# EAGLE design HDC1000_breakout (EAGLE 7.1.0)
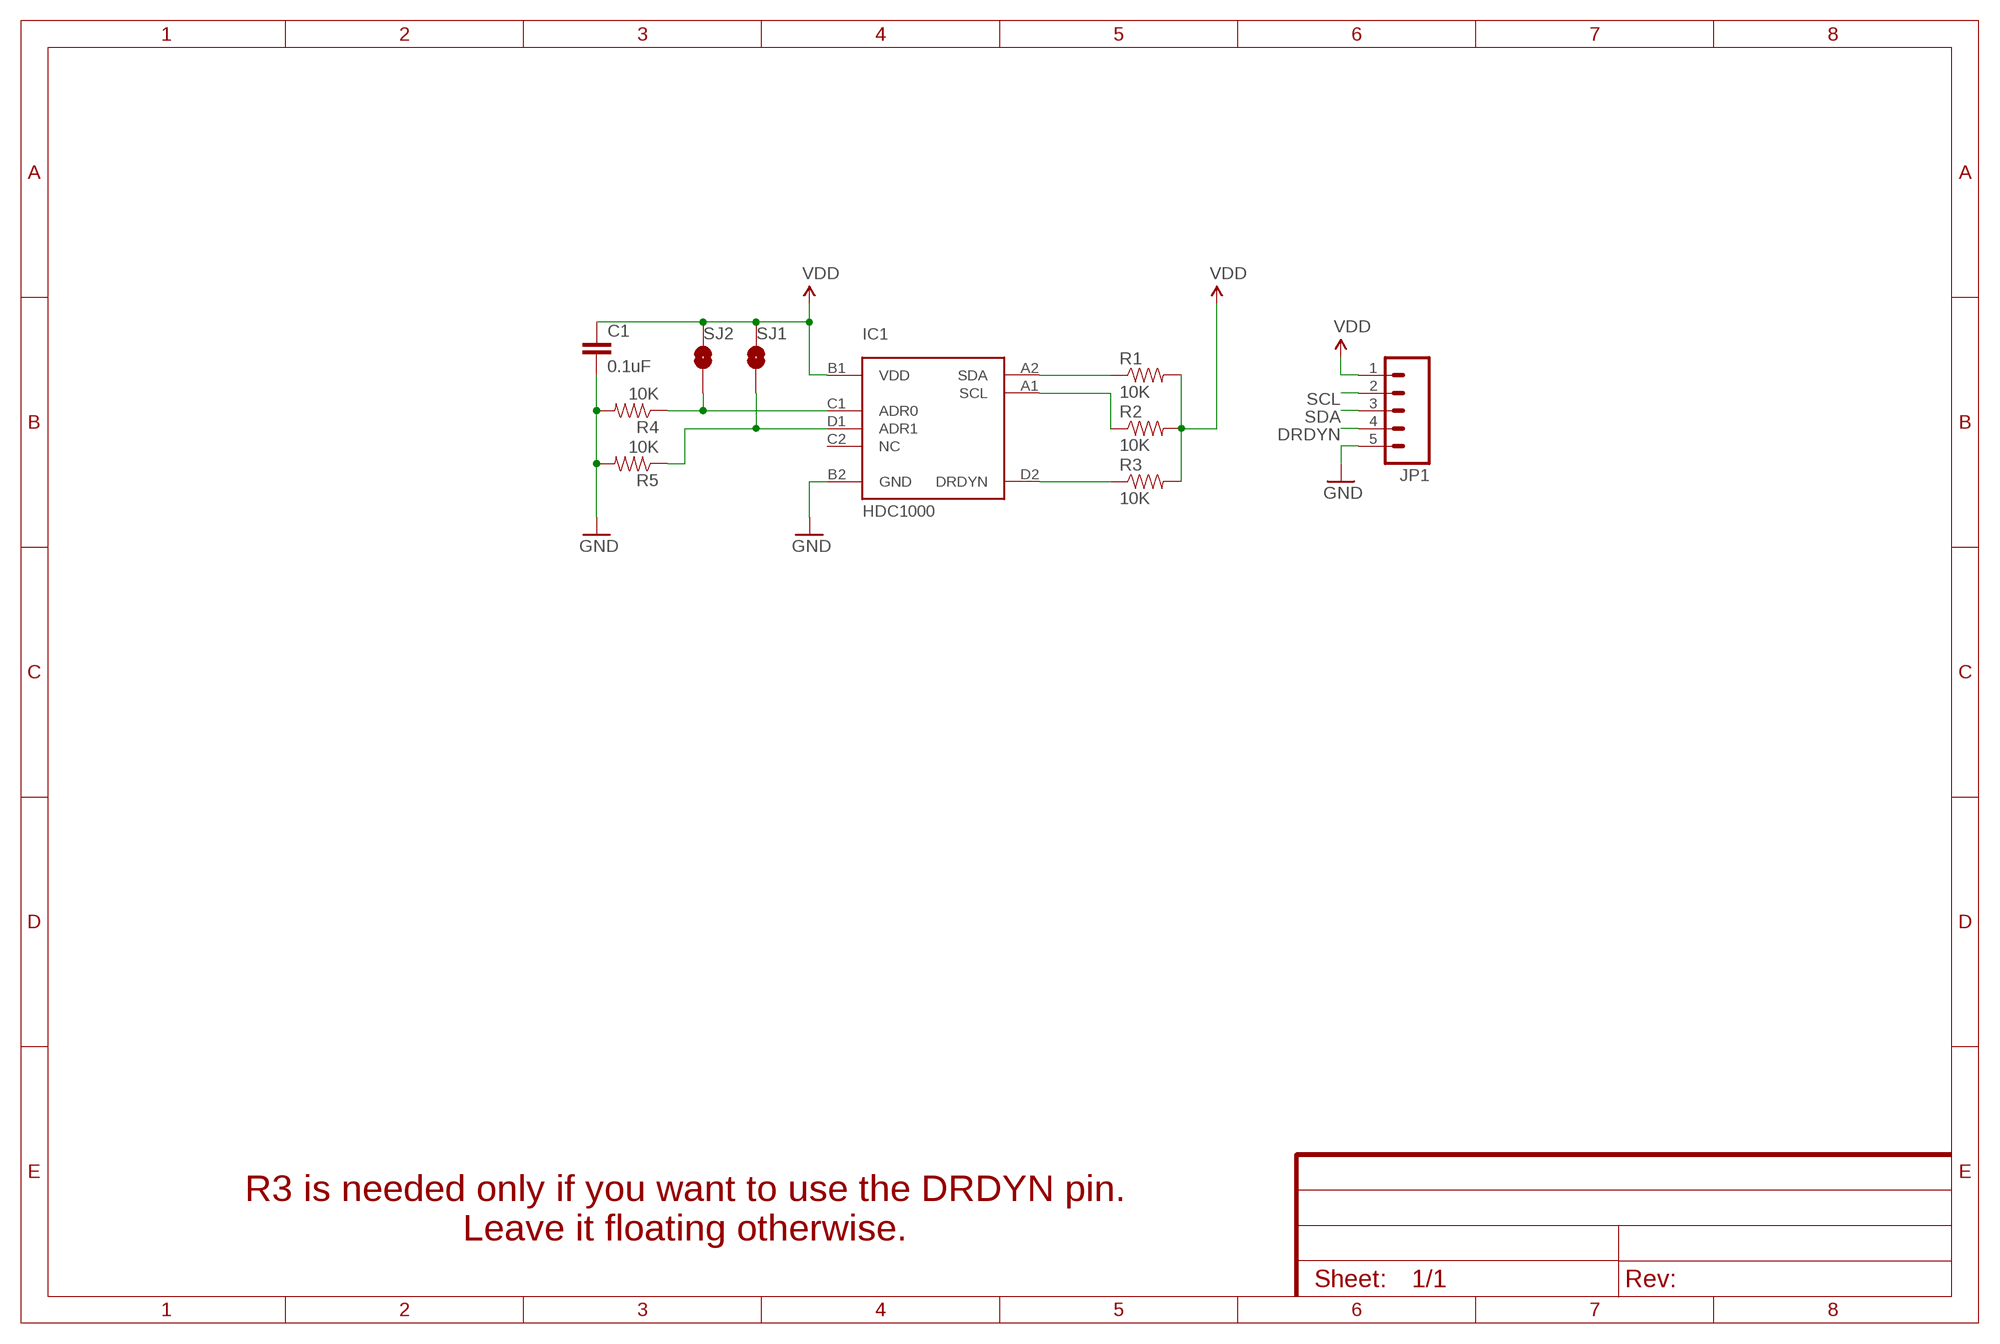
[diagram p0: schematic, sheet 1]
FRAME1 (FRAME-A4L): CNAME: HDC1000 Breakout Board; CREVISION: 1; DESIGNER: Francesco Truzzi; LICENSE: Released under CC BY-NC-SA 4.0

## Parts
C1  0.1uF  CAP0805  [0805]
IC1  HDC1000  [DSBGA_8_YPA]
JP1  M05LOCK  [1X05_LOCK]
R1  10K  RESISTOR0805-RES  [0805]
R2  10K  RESISTOR0805-RES  [0805]
R3  10K  RESISTOR0805-RES  [0805]
R4  10K  RESISTOR0805-RES  [0805]
R5  10K  RESISTOR0805-RES  [0805]
SJ1  SOLDERJUMPERNO  [SJ_2S-NO]
SJ2  SOLDERJUMPERNO  [SJ_2S-NO]

## Nets
DRDYN: IC1.D2(DRDYN) JP1.4 R3.1
GND: C1.2 IC1.B2(GND) JP1.5 R4.2 R5.2
N$1: IC1.D1(ADR1) R5.1 SJ1.2
N$2: IC1.C1(ADR0) R4.1 SJ2.2
SCL: IC1.A1(SCL) JP1.2 R2.1
SDA: IC1.A2(SDA) JP1.3 R1.1
VDD: C1.1 IC1.B1(VDD) JP1.1 R1.2 R2.2 R3.2 SJ1.1 SJ2.1
Unconnected: IC1.C2(NC)

## Notes on the sheet
- R3 is needed only if you want to use the DRDYN pin.
  Leave it floating otherwise.

## Library data of the parts
C1 = SparkFun-Passives:CAP: Capacitor Standard 0603 ceramic capacitor, and 0.1" leaded capacitor.
IC1 = Fra:HDC1000
JP1 = SparkFun-Connectors:M05: Header 5 Standard 5-pin 0.1" header. Use with straight break away headers (SKU : PRT-00116), right angle break away headers (PRT-00553), swiss pins (PRT-00743), machine pins (PRT-00117), and female headers (PRT-00115). Molex polarized connector foot print use with SKU : PRT-08230 with associated crimp pins and housings.
R1-R5 = SparkFun-Passives:RESISTOR: Resistor Basic schematic elements and footprints for 0603, 1206, and PTH resistors.
SJ1 SJ2 = SparkFun-Retired:SOLDERJUMPER: Solder Jumper Standard SMD solder jumper. Used to automate production. Two varients : Normally Open and Normally Closed are the same, but have different paste layers. NC will have a large amount of paste and should jumper during reflow.

## Board
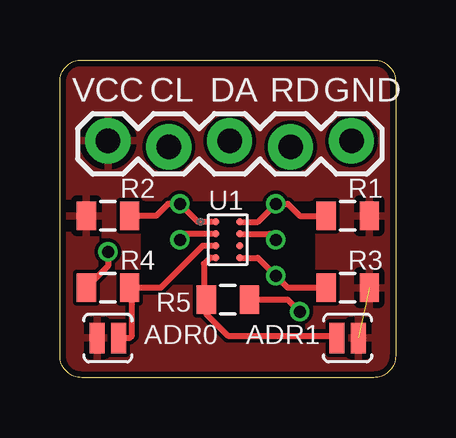
[diagram p1: board, top side]
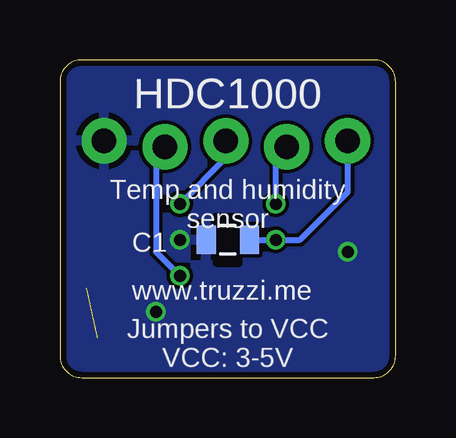
[diagram p2: board, bottom side, seen from below]

Size 14 x 13.25 mm. Coordinates in mm from the lower left corner, seen from the top.
Outline: 14,12.35 14,0.9 arc-90 13.1,0 0.9,0 arc-90 0,0.9 0,12.35 arc-90 0.9,13.25 13.1,13.25 arc-90 14,12.35
Copper layers (1*16): Top 0.035mm / dielectric 1.5mm / Bottom 0.035mm
Design rules "MakerStudio": minimum track width 6mil, minimum drill 12mil, track to track 6mil, track to pad 6mil, pad to pad 6mil, via to via 6mil, smd to smd 0mil, copper to edge 10mil, drill to drill 10mil, minimum pad ring 10mil, minimum via ring 6mil, stop-mask expansion 2mil, vias tented up to drill 100mil, thermal gap 10mil
tRestrict: area 3.5,4 to 10.5,7.2
bRestrict: area 6.5,4.8 to 7.5,6.8

### Footprints (pad centres in the part's own frame; a part is rotated, then mirrored left to right if it is on the bottom)
0805 = smd 0.8 x 1.2: 1 -0.9,0; 2 0.9,0
DSBGA_8_YPA = smd 0.275 x 0.275: A1 -0.5,0.75; A2 0.5,0.75; B1 -0.5,0.25; B2 0.5,0.25; C1 -0.5,-0.25; C2 0.5,-0.25; D1 -0.5,-0.75; D2 0.5,-0.75
1X05_LOCK = drill 1.016 pad 1.88: 1 0,0.127; 2 2.54,-0.127; 3 5.08,0.127; 4 7.62,-0.127; 5 10.16,0.127
SJ_2S-NO = smd 0.635 x 1.27: 1 -0.45,0; 2 0.45,0

### Placement (x,y rotation side)
C1  7,5.75 180 bottom
IC1  7,5.75 0 top
JP1  2,9.75 0 top
R1  12,6.75 0 top
R2  2,6.75 180 top
R3  12,3.75 0 top
R4  2,3.75 180 top
R5  7,3.25 0 top
SJ1  12,1.65 180 top
SJ2  2,1.65 0 top

### Tracks (layer width: path | path; a pad name or v marks a point on that pad's centre or on a via)
DRDYN  (via drill 0.5)
  Top 0.254: IC1.D2 8.25,5 v9,4.25 9.5,3.75 R3.1
  Bottom 0.254: JP1.4 10,9.25 10,5.25 v9,4.25
GND  (via drill 0.5)
  Top 0.254: IC1.B2 8.75,6 v9,5.75 | v2,5.25 2,4.65 R4.2 | v10,2.75 9.5,3.25 R5.2
  pour Bottom: 14,12.35 14,0.9 arc-90 13.1,0 0.9,0 arc-90 0,0.9 0,12.35 arc-90 0.9,13.25 13.1,13.25 arc-90
N$1
  Top 0.254: IC1.D1 6.25,5 6,4.75 6,3.35 R5.1 6.1,2.65 7,1.75 11.45,1.75 SJ1.2
N$2
  Top 0.254: IC1.C1 5.95,5.5 4.2,3.75 R4.1 3,3.65 3,1.75 2.9,1.65 SJ2.2
SCL  (via drill 0.5)
  Top 0.254: R2.1 4,6.75 4.5,7.25 v5,7.25 5.75,6.5 IC1.A1
  Bottom 0.254: v5,7.25 5,9.16 JP1.2
SDA  (via drill 0.5)
  Top 0.254: 10.85,6.5 R1.1 10,6.75 9.5,7.25 v9,7.25 8.25,6.5 IC1.A2
  Bottom 0.254: JP1.3 7.08,9.17 v9,7.25
VDD  (via drill 0.5)  (1 unrouted)
  Top 0.254: IC1.B1 5.25,6 v5,5.75
  Bottom 0.254: C1.1 v5,5.75 4,5.75 2,7.75 JP1.1
  pour Top: 14,12.35 14,0.9 arc-90 13.1,0 0.9,0 arc-90 0,0.9 0,12.35 arc-90 0.9,13.25 13.1,13.25 arc-90

### Text on the board
tPlace: VCC | CL | DA | RD | GND | ADR0 | ADR1
bPlace: HDC1000 | Temp and humidity / sensor | www.truzzi.me | Jumpers to VCC / VCC: 3-5V
tNames: R2 | R1 | U1 | R4 | R3 | R5
bNames: C1